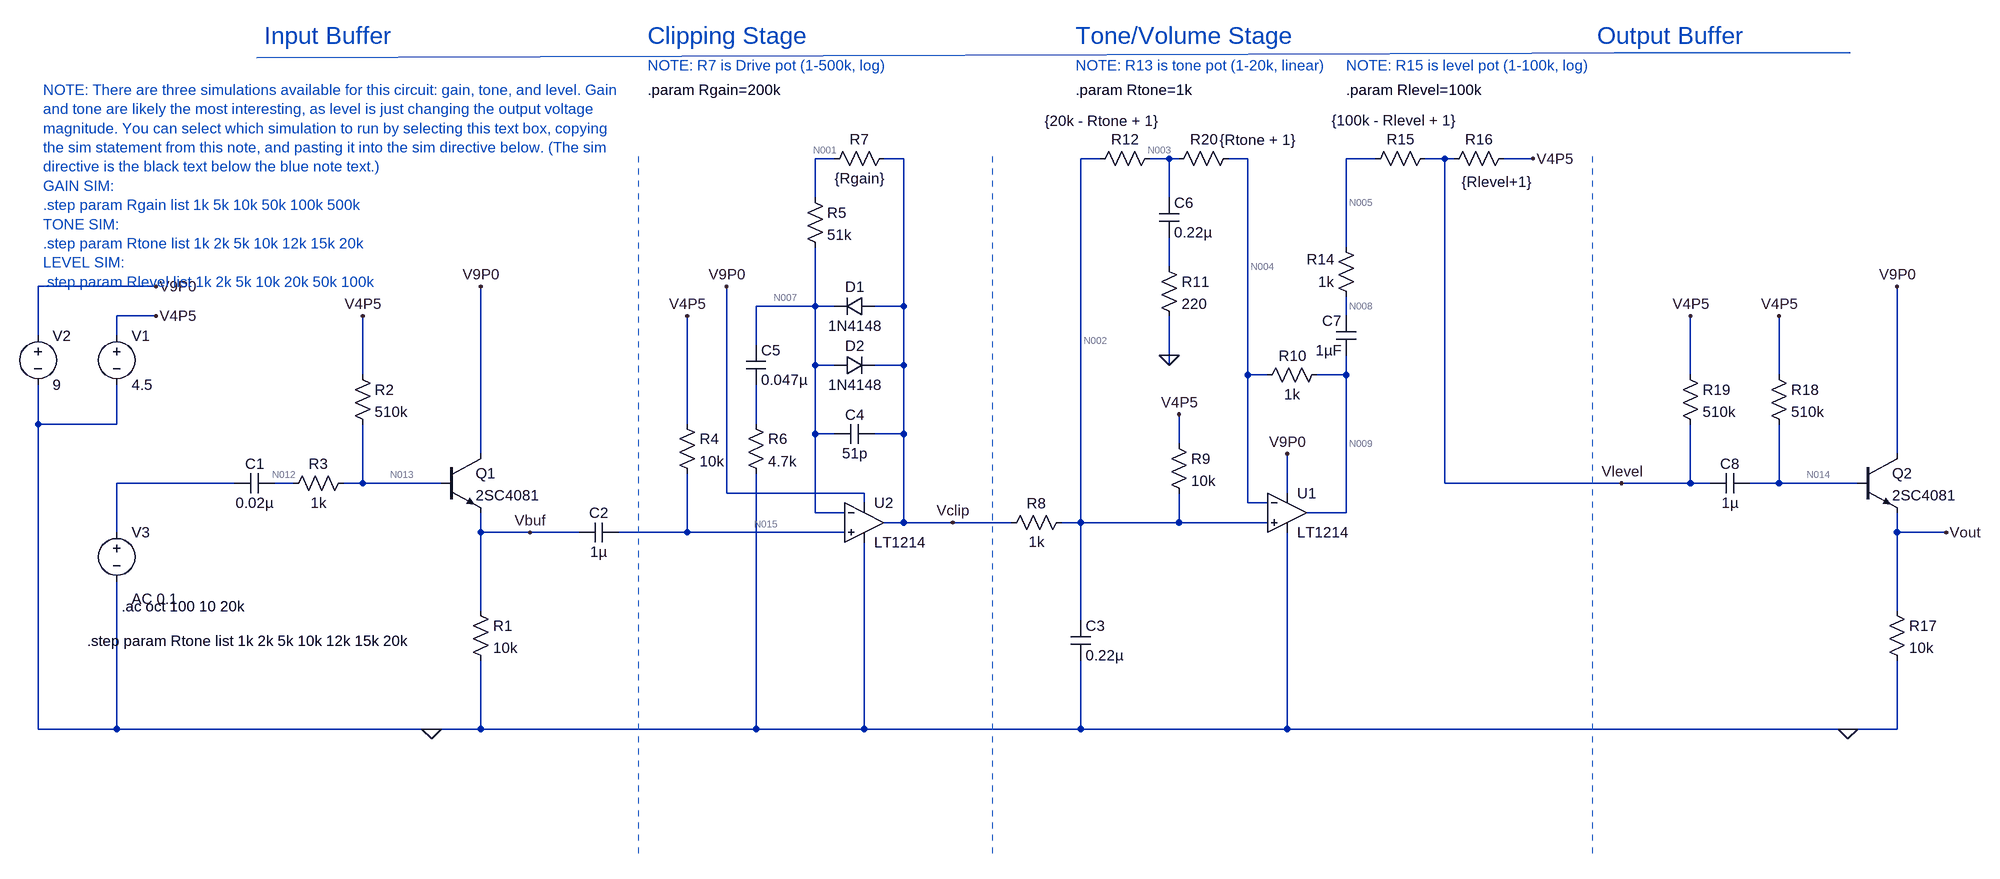
[diagram p0: schematic tube_screamer_backup.asc]
tube_screamer_backup.asc, the LTspice schematic file:
Version 4
SHEET 1 2884 952
WIRE 1008 -192 976 -192
WIRE 1120 -192 1088 -192
WIRE 1440 -192 1408 -192
WIRE 1552 -192 1520 -192
WIRE 1568 -192 1552 -192
WIRE 1680 -192 1648 -192
WIRE 1888 -192 1840 -192
WIRE 2000 -192 1968 -192
WIRE 2016 -192 2000 -192
WIRE 2144 -192 2096 -192
WIRE 976 -128 976 -192
WIRE 1552 -128 1552 -192
WIRE 1840 -48 1840 -192
WIRE 1552 -16 1552 -64
WIRE -96 16 -288 16
WIRE 976 48 976 -48
WIRE 976 48 880 48
WIRE 1008 48 976 48
WIRE 1120 48 1120 -192
WIRE 1120 48 1072 48
WIRE -96 64 -160 64
WIRE 1840 64 1840 32
WIRE -288 96 -288 16
WIRE -160 96 -160 64
WIRE 880 112 880 48
WIRE 1552 128 1552 64
WIRE 976 144 976 48
WIRE 1008 144 976 144
WIRE 1120 144 1120 48
WIRE 1120 144 1072 144
WIRE 1552 144 1552 128
WIRE 240 160 240 64
WIRE 1680 160 1680 -192
WIRE 1712 160 1680 160
WIRE 1840 160 1840 128
WIRE 1840 160 1792 160
WIRE 2400 160 2400 64
WIRE 2544 160 2544 64
WIRE -288 240 -288 176
WIRE -160 240 -160 176
WIRE -160 240 -288 240
WIRE 768 240 768 64
WIRE 880 240 880 176
WIRE 976 256 976 144
WIRE 1008 256 976 256
WIRE 1120 256 1120 144
WIRE 1120 256 1072 256
WIRE 1568 272 1568 224
WIRE 432 288 432 16
WIRE 2736 288 2736 16
WIRE 32 336 -160 336
WIRE 128 336 96 336
WIRE 240 336 240 240
WIRE 240 336 208 336
WIRE 368 336 240 336
WIRE 2000 336 2000 -192
WIRE 2288 336 2000 336
WIRE 2400 336 2400 240
WIRE 2400 336 2288 336
WIRE 2432 336 2400 336
WIRE 2544 336 2544 240
WIRE 2544 336 2496 336
WIRE 2672 336 2544 336
WIRE 832 352 832 16
WIRE 1056 352 832 352
WIRE 1744 352 1744 288
WIRE 1056 368 1056 352
WIRE 1680 368 1680 160
WIRE 1712 368 1680 368
WIRE 976 384 976 256
WIRE 1024 384 976 384
WIRE 1840 384 1840 160
WIRE 1840 384 1776 384
WIRE 1120 400 1120 256
WIRE 1120 400 1088 400
WIRE 1200 400 1120 400
WIRE 1296 400 1200 400
WIRE 1408 400 1408 -192
WIRE 1408 400 1376 400
WIRE 1568 400 1568 352
WIRE 1568 400 1408 400
WIRE 1712 400 1568 400
WIRE -160 416 -160 336
WIRE 432 416 432 384
WIRE 512 416 432 416
WIRE 592 416 512 416
WIRE 768 416 768 320
WIRE 768 416 656 416
WIRE 1024 416 768 416
WIRE 2736 416 2736 384
WIRE 2816 416 2736 416
WIRE 432 544 432 416
WIRE 2736 544 2736 416
WIRE 1408 560 1408 400
WIRE -288 736 -288 240
WIRE -160 736 -160 496
WIRE -160 736 -288 736
WIRE 352 736 -160 736
WIRE 432 736 432 624
WIRE 432 736 352 736
WIRE 880 736 880 320
WIRE 880 736 432 736
WIRE 1056 736 1056 432
WIRE 1056 736 880 736
WIRE 1408 736 1408 624
WIRE 1408 736 1056 736
WIRE 1744 736 1744 416
WIRE 1744 736 1408 736
WIRE 2656 736 1744 736
WIRE 2736 736 2736 624
WIRE 2736 736 2656 736
FLAG 352 736 0
FLAG 512 416 Vbuf
FLAG 1200 400 Vclip
FLAG -96 16 V9P0
FLAG 432 16 V9P0
FLAG 832 16 V9P0
FLAG -96 64 V4P5
FLAG 240 64 V4P5
FLAG 768 64 V4P5
FLAG 1744 288 V9P0
FLAG 1568 224 V4P5
FLAG 1552 128 0
FLAG 2144 -192 V4P5
FLAG 2656 736 0
FLAG 2816 416 Vout
FLAG 2736 16 V9P0
FLAG 2544 64 V4P5
FLAG 2400 64 V4P5
FLAG 2288 336 Vlevel
SYMBOL npn 368 288 R0
SYMATTR InstName Q1
SYMATTR Value 2SC4081
SYMBOL res 416 528 R0
SYMATTR InstName R1
SYMATTR Value 10k
SYMBOL res 224 144 R0
SYMATTR InstName R2
SYMATTR Value 510k
SYMBOL res 224 320 R90
WINDOW 0 0 56 VBottom 2
WINDOW 3 32 56 VTop 2
SYMATTR InstName R3
SYMATTR Value 1k
SYMBOL cap 96 320 R90
WINDOW 0 0 32 VBottom 2
WINDOW 3 32 32 VTop 2
SYMATTR InstName C1
SYMATTR Value 0.02µ
SYMBOL cap 656 400 R90
WINDOW 0 0 32 VBottom 2
WINDOW 3 32 32 VTop 2
SYMATTR InstName C2
SYMATTR Value 1µ
SYMBOL voltage -160 80 R0
SYMATTR InstName V1
SYMATTR Value 4.5
SYMATTR SpiceLine Rser=0
SYMBOL voltage -288 80 R0
SYMATTR InstName V2
SYMATTR Value 9
SYMATTR SpiceLine Rser=0
SYMBOL voltage -160 400 R0
WINDOW 123 24 124 Left 2
WINDOW 39 0 0 Left 0
SYMATTR InstName V3
SYMATTR Value ""
SYMATTR Value2 AC 0.1
SYMBOL res 752 224 R0
SYMATTR InstName R4
SYMATTR Value 10k
SYMBOL cap 1072 240 R90
WINDOW 0 0 32 VBottom 2
WINDOW 3 32 32 VTop 2
SYMATTR InstName C4
SYMATTR Value 51p
SYMBOL diode 1072 32 R90
WINDOW 0 0 32 VBottom 2
WINDOW 3 32 32 VTop 2
SYMATTR InstName D1
SYMATTR Value 1N4148
SYMBOL diode 1008 160 R270
WINDOW 0 32 32 VTop 2
WINDOW 3 0 32 VBottom 2
SYMATTR InstName D2
SYMATTR Value 1N4148
SYMBOL res 960 -144 R0
SYMATTR InstName R5
SYMATTR Value 51k
SYMBOL res 864 224 R0
SYMATTR InstName R6
SYMATTR Value 4.7k
SYMBOL cap 864 112 R0
SYMATTR InstName C5
SYMATTR Value 0.047µ
SYMBOL res 1104 -208 R90
WINDOW 0 0 56 VBottom 2
WINDOW 3 32 56 VTop 2
SYMATTR InstName R7
SYMATTR Value {Rgain}
SYMBOL Opamps/LT1214 1056 336 R0
SYMATTR InstName U2
SYMBOL res 1392 384 R90
WINDOW 0 0 56 VBottom 2
WINDOW 3 32 56 VTop 2
SYMATTR InstName R8
SYMATTR Value 1k
SYMBOL cap 1392 560 R0
SYMATTR InstName C3
SYMATTR Value 0.22µ
SYMBOL res 1552 256 R0
SYMATTR InstName R9
SYMATTR Value 10k
SYMBOL Opamps/LT1214 1744 320 R0
SYMATTR InstName U1
SYMBOL res 1808 144 R90
WINDOW 0 0 56 VBottom 2
WINDOW 3 32 56 VTop 2
SYMATTR InstName R10
SYMATTR Value 1k
SYMBOL cap 1536 -128 R0
SYMATTR InstName C6
SYMATTR Value 0.22µ
SYMBOL res 1536 -32 R0
SYMATTR InstName R11
SYMATTR Value 220
SYMBOL res 1536 -208 R90
WINDOW 0 0 56 VBottom 2
WINDOW 3 -61 95 VTop 2
SYMATTR InstName R12
SYMATTR Value {20k - Rtone + 1}
SYMBOL cap 1856 128 R180
WINDOW 0 24 56 Left 2
WINDOW 3 24 8 Left 2
SYMATTR InstName C7
SYMATTR Value 1µF
SYMBOL res 1856 48 R180
WINDOW 0 36 76 Left 2
WINDOW 3 36 40 Left 2
SYMATTR InstName R14
SYMATTR Value 1k
SYMBOL res 1984 -208 R90
WINDOW 0 0 56 VBottom 2
WINDOW 3 -62 68 VTop 2
SYMATTR InstName R15
SYMATTR Value {100k - Rlevel + 1}
SYMBOL res 2112 -208 R90
WINDOW 0 0 56 VBottom 2
WINDOW 3 38 29 VTop 2
SYMATTR InstName R16
SYMATTR Value {Rlevel+1}
SYMBOL npn 2672 288 R0
SYMATTR InstName Q2
SYMATTR Value 2SC4081
SYMBOL res 2720 528 R0
SYMATTR InstName R17
SYMATTR Value 10k
SYMBOL res 2528 144 R0
SYMATTR InstName R18
SYMATTR Value 510k
SYMBOL cap 2496 320 R90
WINDOW 0 0 32 VBottom 2
WINDOW 3 32 32 VTop 2
SYMATTR InstName C8
SYMATTR Value 1µ
SYMBOL res 2384 144 R0
SYMATTR InstName R19
SYMATTR Value 510k
SYMBOL res 1664 -208 R90
WINDOW 0 0 56 VBottom 2
WINDOW 3 -30 -31 VTop 2
SYMATTR InstName R20
SYMATTR Value {Rtone + 1}
TEXT -152 536 Left 2 !.ac oct 100 10 20k
TEXT 80 -392 Left 4 ;Input Buffer
TEXT 704 -392 Left 4 ;Clipping Stage
TEXT 704 -344 Left 2 ;NOTE: R7 is Drive pot (1-500k, log)
TEXT 704 -304 Left 2 !.param Rgain=200k
TEXT -208 592 Left 2 !.step param Rtone list 1k 2k 5k 10k 12k 15k 20k
TEXT 1400 -392 Left 4 ;Tone/Volume Stage
TEXT 1400 -344 Left 2 ;NOTE: R13 is tone pot (1-20k, linear)
TEXT 1400 -304 Left 2 !.param Rtone=1k
TEXT 1840 -344 Left 2 ;NOTE: R15 is level pot (1-100k, log)
TEXT 1840 -304 Left 2 !.param Rlevel=100k
TEXT 2248 -392 Left 4 ;Output Buffer
TEXT -280 -304 Left 2 ;NOTE: There are three simulations available for this circuit: gain, tone, and level. Gain \nand tone are likely the most interesting, as level is just changing the output voltage \nmagnitude. You can select which simulation to run by selecting this text box, copying \nthe sim statement from this note, and pasting it into the sim directive below. (The sim \ndirective is the black text below the blue note text.)\nGAIN SIM:\n.step param Rgain list 1k 5k 10k 50k 100k 500k\nTONE SIM:\n.step param Rtone list 1k 2k 5k 10k 12k 15k 20k\nLEVEL SIM:\n.step param Rlevel list 1k 2k 5k 10k 20k 50k 100k
LINE Normal 688 -196 688 948 2
LINE Normal 1264 -196 1264 948 2
LINE Normal 68 -356 2372 -364
LINE Normal 2276 -364 2660 -364
LINE Normal 2240 -196 2240 948 2

The netlist it stands for:
* tube_screamer_backup.asc
Q1 V9P0 N013 Vbuf 0 2SC4081
R1 Vbuf 0 10k
R2 V4P5 N013 510k
R3 N013 N012 1k
C1 N012 N011 0.02µ
C2 N015 Vbuf 1µ
V1 V4P5 0 4.5 Rser=0
V2 V9P0 0 9 Rser=0
V3 N011 0 AC 0.1
R4 V4P5 N015 10k
C4 Vclip N007 51p
D1 Vclip N007 1N4148
D2 N007 Vclip 1N4148
R5 N001 N007 51k
R6 N010 0 4.7k
C5 N007 N010 0.047µ
R7 Vclip N001 {Rgain}
XU2 N015 N007 V9P0 0 Vclip LT1213  ; LT1214, pins In+ In- V+ V- OUT
R8 N002 Vclip 1k
C3 N002 0 0.22µ
R9 V4P5 N002 10k
XU1 N002 N004 V9P0 0 N009 LT1213  ; LT1214, pins In+ In- V+ V- OUT
R10 N009 N004 1k
C6 N003 N006 0.22µ
R11 N006 0 220
R12 N003 N002 {20k - Rtone + 1}
C7 N009 N008 1µF
R14 N008 N005 1k
R15 Vlevel N005 {100k - Rlevel + 1}
R16 V4P5 Vlevel {Rlevel+1}
Q2 V9P0 N014 Vout 0 2SC4081
R17 Vout 0 10k
R18 V4P5 N014 510k
C8 N014 Vlevel 1µ
R19 V4P5 Vlevel 510k
R20 N004 N003 {Rtone + 1}
.model D D
.lib standard.dio
.model NPN NPN
.model PNP PNP
.lib standard.bjt
.ac oct 100 10 20k
* Input Buffer
* Clipping Stage
* NOTE: R7 is Drive pot (1-500k, log)
.param Rgain=200k
.step param Rtone list 1k 2k 5k 10k 12k 15k 20k
* Tone/Volume Stage
* NOTE: R13 is tone pot (1-20k, linear)
.param Rtone=1k
* NOTE: R15 is level pot (1-100k, log)
.param Rlevel=100k
* Output Buffer
* NOTE: There are three simulations available for this circuit: gain, tone, and level. Gain
* and tone are likely the most interesting, as level is just changing the output voltage
* magnitude. You can select which simulation to run by selecting this text box, copying
* the sim statement from this note, and pasting it into the sim directive below. (The sim
* directive is the black text below the blue note text.)
* GAIN SIM:
* .step param Rgain list 1k 5k 10k 50k 100k 500k
* TONE SIM:
* .step param Rtone list 1k 2k 5k 10k 12k 15k 20k
* LEVEL SIM:
* .step param Rlevel list 1k 2k 5k 10k 20k 50k 100k
.lib LTC.lib
.backanno
.end

* Results of the author's LTspice run, read from the files saved beside the schematic
* Operating Point (first step), zero values left out:
*   rtone = 1 k
*   V(v9p0) = 9 V
*   V(n013) = 3.907 V
*   V(vbuf) = 3.332 V
*   V(v4p5) = 4.5 V
*   V(n012) = 3.907 V
*   V(n015) = 4.501 V
*   V(vclip) = 4.481 V
*   V(n007) = 4.501 V
*   V(n001) = 4.497 V
*   V(n002) = 4.483 V
*   V(n004) = 4.483 V
*   V(n009) = 4.483 V
*   V(n003) = 4.483 V
*   V(n008) = 4.5 V
*   V(n005) = 4.5 V
*   V(vlevel) = 4.5 V
*   V(n014) = 3.907 V
*   V(vout) = 3.332 V
*   Ic(Q2) = 332 µA
*   Ib(Q2) = 1.163 µA
*   Ie(Q2) = -333.2 µA
*   Ic(Q1) = 332 µA
*   Ib(Q1) = 1.163 µA
*   Ie(Q1) = -333.2 µA
*   I(D2) = 1.357 nA
*   I(D1) = -881.9 pA
*   I(R20) = -10.35 pA
*   I(R18) = 1.163 µA
*   I(R17) = 333.2 µA
*   I(R12) = -10.35 pA
*   I(R10) = -80.1 nA
*   I(R9) = 1.694 µA
*   I(R8) = 1.774 µA
*   I(R7) = -77.76 nA
*   I(R5) = -77.76 nA
*   I(R4) = -80 nA
*   I(R2) = 1.163 µA
*   I(R1) = 333.2 µA
*   I(V2) = -6.063 mA
*   I(V1) = -3.94 µA
*   Ix(u2:1) = -80 nA
*   Ix(u2:2) = -80 nA
*   Ix(u2:3) = 2.699 mA
*   Ix(u2:4) = -2.701 mA
*   Ix(u2:5) = 1.854 µA
*   Ix(u1:1) = -80.09 nA
*   Ix(u1:2) = -80.09 nA
*   Ix(u1:3) = 2.7 mA
*   Ix(u1:4) = -2.7 mA
*   Ix(u1:5) = 80.1 nA